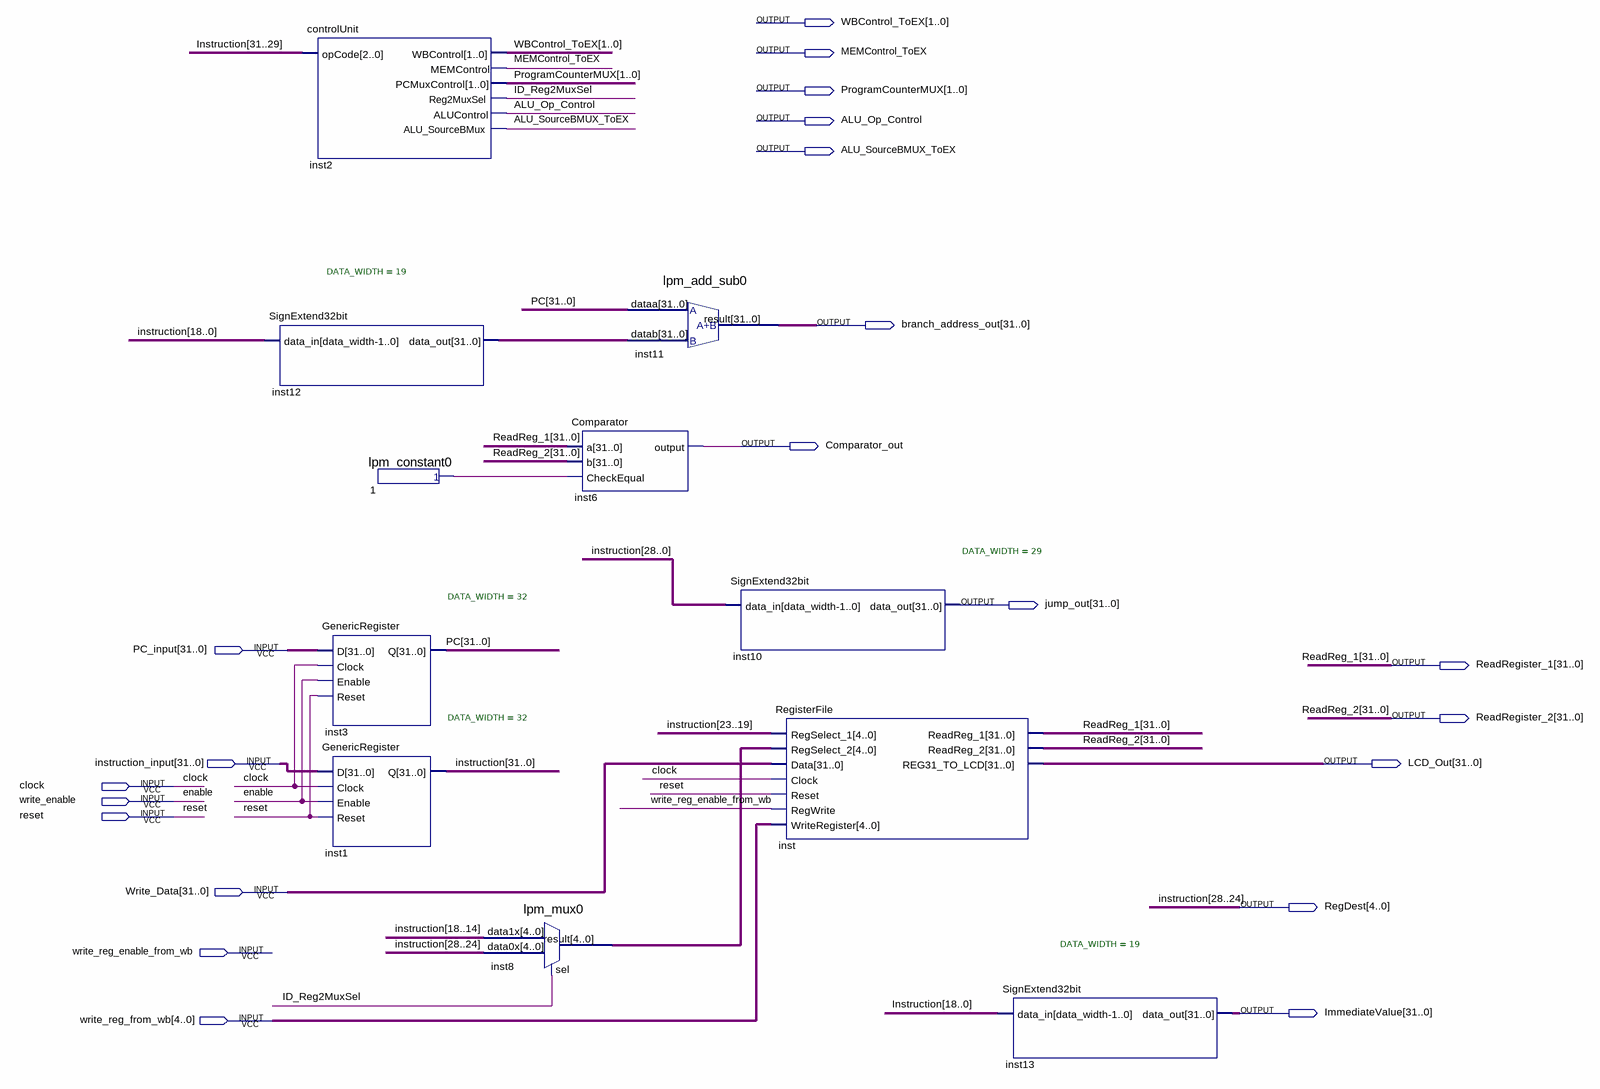
[diagram p0: schematic sheet]
// Quartus schematic DecodeStage.bdf as structural Verilog: 11 symbols, 21 pins
module DecodeStage (
  input  [31:0] PC_input,
  input  [31:0] instruction_input,
  input  clock,
  input  write_enable,
  input  reset,
  input  [31:0] Write_Data,
  input  write_reg_enable_from_wb,
  input  [4:0] write_reg_from_wb,
  output [1:0] WBControl_ToEX,
  output MEMControl_ToEX,
  output [1:0] ProgramCounterMUX,
  output ALU_Op_Control,
  output ALU_SourceBMUX_ToEX,
  output [31:0] branch_address_out,
  output Comparator_out,
  output [31:0] jump_out,
  output [31:0] ReadRegister_1,
  output [31:0] ReadRegister_2,
  output [31:0] LCD_Out,
  output [4:0] RegDest,
  output [31:0] ImmediateValue
);

  wire ID_Reg2MuxSel, n1_result;
  wire [4:0] inst8_result;
  wire [31:0] inst12_data_out, instruction, PC;

  controlUnit inst2 (
    .opCode(instruction[31:29]), .WBControl(WBControl_ToEX), .MEMControl(MEMControl_ToEX),
    .PCMuxControl(ProgramCounterMUX), .Reg2MuxSel(ID_Reg2MuxSel), .ALUControl(ALU_Op_Control),
    .ALU_SourceBMux(ALU_SourceBMUX_ToEX));
  SignExtend32bit #(.DATA_WIDTH(19)) inst12 (.data_in(instruction[18:0]), .data_out(inst12_data_out));
  lpm_constant0 u_1 (.result(n1_result));
  GenericRegister #(.DATA_WIDTH(32)) inst3 (.D(PC_input), .Clock(clock), .Enable(write_enable), .Reset(reset), .Q(PC));
  GenericRegister #(.DATA_WIDTH(32)) inst1 (
    .D(instruction_input), .Clock(clock), .Enable(write_enable), .Reset(reset),
    .Q({instruction[31:29], RegDest, instruction[23:0]}));
  lpm_mux0 inst8 (.data1x(instruction[18:14]), .data0x(RegDest), .sel(ID_Reg2MuxSel), .result(inst8_result));
  Comparator inst6 (.a(ReadRegister_1), .b(ReadRegister_2), .CheckEqual(n1_result), .\output (Comparator_out));
  lpm_add_sub0 inst11 (.dataa(PC), .datab(inst12_data_out), .result(branch_address_out));
  SignExtend32bit #(.DATA_WIDTH(29)) inst10 (.data_in({RegDest, instruction[23:0]}), .data_out(jump_out));
  RegisterFile inst (
    .RegSelect_1(instruction[23:19]), .RegSelect_2(inst8_result), .Data(Write_Data), .Clock(clock),
    .Reset(reset), .RegWrite(write_reg_enable_from_wb), .WriteRegister(write_reg_from_wb),
    .ReadReg_1(ReadRegister_1), .ReadReg_2(ReadRegister_2), .REG31_TO_LCD(LCD_Out));
  SignExtend32bit #(.DATA_WIDTH(19)) inst13 (.data_in(instruction[18:0]), .data_out(ImmediateValue));

  // Other names for the same wires on the sheet: enable = write_enable; instruction[28:24] = RegDest;
  //   ReadReg_1[31:0] = ReadRegister_1; ReadReg_2[31:0] = ReadRegister_2
endmodule
